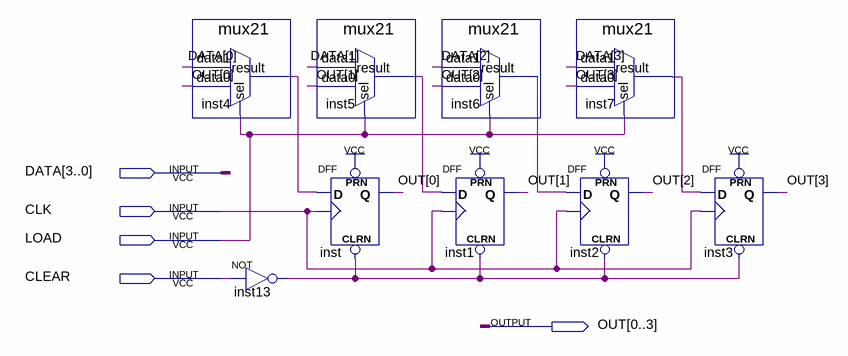
[diagram p0: schematic sheet]
// Quartus schematic REGISTRADOR.bdf as structural Verilog: 9 symbols, 5 pins
module REGISTRADOR (
  input  [3:0] DATA,
  input  CLK,
  input  LOAD,
  input  CLEAR,
  output [0:3] OUT
);

  wire inst4_result, inst5_result, inst6_result, inst7_result, inst13_out;

  mux21 inst4 (.data1(DATA[0]), .data0(OUT[0]), .sel(LOAD), .result(inst4_result));
  not inst13 (inst13_out, CLEAR);
  mux21 inst5 (.data1(DATA[1]), .data0(OUT[1]), .sel(LOAD), .result(inst5_result));
  DFF inst (.CLRN(inst13_out), .CLK(CLK), .D(inst4_result), .PRN(1'b1), .Q(OUT[0]));
  mux21 inst6 (.data1(DATA[2]), .data0(OUT[2]), .sel(LOAD), .result(inst6_result));
  DFF inst1 (.CLRN(inst13_out), .CLK(CLK), .D(inst5_result), .PRN(1'b1), .Q(OUT[1]));
  mux21 inst7 (.data1(DATA[3]), .data0(OUT[3]), .sel(LOAD), .result(inst7_result));
  DFF inst2 (.CLRN(inst13_out), .CLK(CLK), .D(inst6_result), .PRN(1'b1), .Q(OUT[2]));
  DFF inst3 (.CLRN(inst13_out), .CLK(CLK), .D(inst7_result), .PRN(1'b1), .Q(OUT[3]));
endmodule
